# Altium schematic sheet m3406.SchDoc
size A4; SheetNumber: 4; SheetTotal: 4
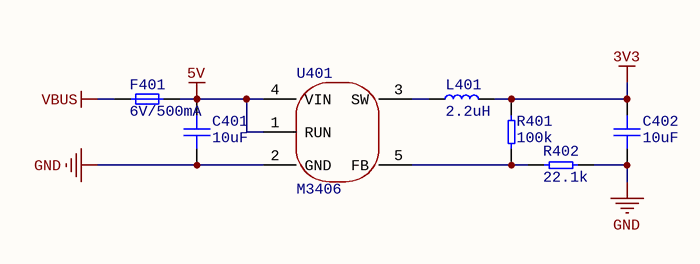
[diagram p0: m3406.SchDoc]

## Parts
C401  10uF  [fp-0006]
C402  10uF  [fp-0006]
F401  6V/500mA  [fp-0008]
L401  2.2uH  [fp-0021]
R401  100k  [fp-0002]
R402  22.1k  [fp-0002]
U401  M3406  [fp-0020]

## Nets
3V3: C402.2 L401.2 R401.2
5V: C401.2 F401.2 U401.1(RUN) U401.4(VIN)
GND: C401.1 C402.1 R402.2 U401.2(GND)
VBUS: F401.1
NetL401_1: L401.1 U401.3(SW)
NetR401_1: R401.1 R402.1 U401.5(FB)

## Library data of the parts
C401 C402 = CMP-0000026: 10V 10uF X5R ±10% 0603 Multilayer Ceramic Capacitors MLCC - SMD/SMT ROHS; MPN: TCC0603X5R106K100CT; Manufacturer: CCTC; CPN: 000000; ID: CMP-0000026; Category: Capacitors; GPN: 10uF; ComponentLink1Description: Product Link; ComponentLink2Description: Datasheet Link; LCSC PN: C380314
F401 = CMP-0000015: 6V 500mA 100A 1A 0805 Resettable Fuses ROHS; MPN: SMD0805B050TF; Manufacturer: BrightKing; CPN: 000000; ID: CMP-0000015; Category: Fuses; GPN: 6V/500mA; ComponentLink1Description: Product Link; ComponentLink1URL: https://brightking.yageo.com/Products/info_12.aspx?itemid=1343; ComponentLink2Description: Datasheet Link; ComponentLink2URL: https://brightking.yageo.com/uploadfiles/file/PTC/2022042723144014408764.pdf; LCSC PN: C269104
L401 = CMP-0000031: 2.2uH SMD,2x1.6mm Power Inductors ROHS; MPN: SFE201610-2R2M; Manufacturer: DDY; CPN: 10011400052; ID: CMP-0000031; Category: Inductors; GPN: 2.2uH; ComponentLink1Description: Product Link; ComponentLink1URL: https://www.lcsc.com/product-detail/Power-Inductors_DDY-SFE201610-2R2M_C5159659.html; ComponentLink2Description: Datasheet Link; ComponentLink2URL: https://www.lcsc.com/datasheet/lcsc_datasheet_2210091830_DDY-SFE201610-2R2M_C5159659.pdf; LCSC PN: C5159659
R401 = CMP-0000003: 62.5mW Thick Film Resistors 50V ±100ppm/℃ ±1% 100kΩ 0402 Chip Resistor - Surface Mount ROHS; MPN: RTT021003FTH; Manufacturer: RALEC; CPN: 000000; ID: CMP-0000003; Category: Resistors; GPN: 100k; ComponentLink1Description: Product Link; ComponentLink2Description: Datasheet Link; LCSC PN: C102750
R402 = CMP-0000030: 62.5mW Thick Film Resistors 50V ±100ppm/℃ ±1% 22.1kΩ 0402 Chip Resistor - Surface Mount ROHS; MPN: 0402WGF2212TCE; Manufacturer: UNI-ROYAL; CPN: 000000; ID: CMP-0000030; Category: Resistors; GPN: 22.1k; ComponentLink1Description: Product Link; ComponentLink2Description: Datasheet Link; LCSC PN: C43473
U401 = CMP-0000036: Step-down type SOT-23-5 DC-DC Converters ROHS; MPN: M3406-ADJ; Manufacturer: AEROSEMI; CPN: 10010200097; ID: CMP-0000036; Category: ICs; GPN: M3406; ComponentLink1Description: Product Link; ComponentLink1URL: https://www.lcsc.com/product-detail/DC-DC-Converters_XI-AN-Aerosemi-Tech-M3406-ADJ_C83224.html; ComponentLink2Description: Datasheet Link; ComponentLink2URL: https://www.lcsc.com/datasheet/lcsc_datasheet_2304140030_XI-AN-Aerosemi-Tech-M3406-ADJ_C83224.pdf; LCSC PN: C83224